# Altium schematic sheet Sheet1.SchDoc
size A4
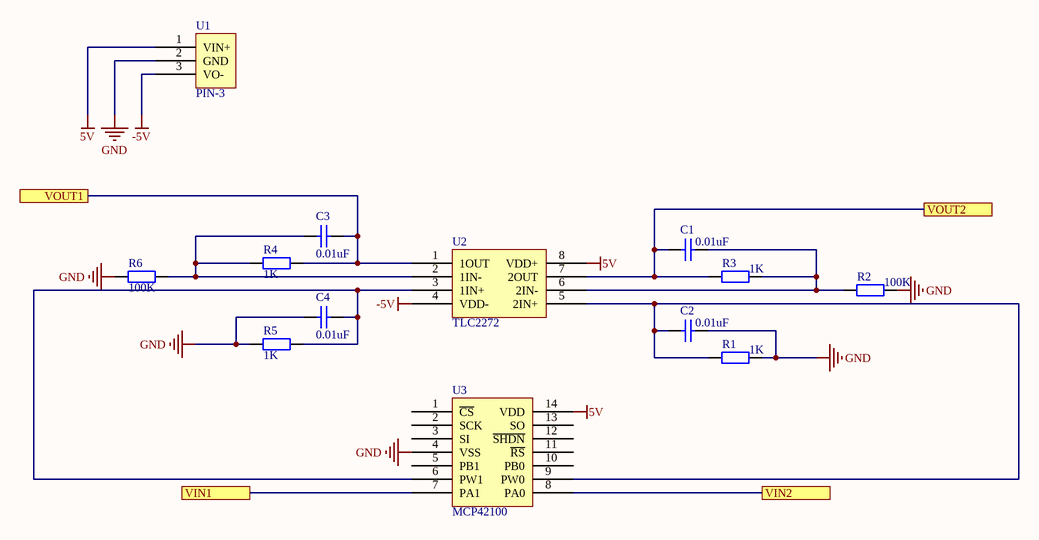
[diagram p0: Sheet1.SchDoc]

## Parts
C1  value 0.01uF  [RAD-0.3]  (hidden comment: Cap)
C2  value 0.01uF  [RAD-0.3]  (hidden comment: Cap)
C3  value 0.01uF  [RAD-0.3]  (hidden comment: Cap)
C4  value 0.01uF  [RAD-0.3]  (hidden comment: Cap)
R1  value 1K  [AXIAL-0.4]  (hidden comment: Res2)
R2  value 100K  [AXIAL-0.4]  (hidden comment: Res2)
R3  value 1K  [AXIAL-0.4]  (hidden comment: Res2)
R4  value 1K  [AXIAL-0.4]  (hidden comment: Res2)
R5  value 1K  [AXIAL-0.4]  (hidden comment: Res2)
R6  value 100K  [AXIAL-0.4]  (hidden comment: Res2)
U1  PIN-3
U2  TLC2272
U3  MCP42100

## Ports
VIN1, VIN2, VOUT1, VOUT2

## Nets
5V: U1.1(VIN+) U2.8(VDD+) U3.14(VDD)
-5V: U1.3(VO-) U2.4(VDD-)
GND: C2.2 C4.2 R1.2 R2.2 R5.2 R6.2 U1.2(GND) U3.4(VSS)
VIN1: U3.7(PA1) ; port VIN1
VIN2: U3.8(PA0) ; port VIN2
VOUT1: C3.1 R4.1 U2.1(1OUT) ; port VOUT1
VOUT2: C1.1 R3.1 U2.7(2OUT) ; port VOUT2
NetC1_2: C1.2 R2.1 R3.2 U2.6(2IN-)
NetC2_1: C2.1 R1.1 U2.5(2IN+) U3.9(PW0)
NetC3_2: C3.2 R4.2 R6.1 U2.2(1IN-)
NetC4_1: C4.1 R5.1 U2.3(1IN+) U3.6(PW1)

Not connected (* = marked no-connect by the designer): U3 1(~{CS}) 2(SCK) 3(SI) 5(PB1) 10(PB0) 11(~{RS}) 12(~{SHDN}) 13(SO)

## Library data of the parts
C1-C4 = Cap: Capacitor; Published: 8-Jun-2000; LatestRevisionDate: 17-Jul-2002; LatestRevisionNote: Re-released for DXP Platform.; PackageReference: RAD-0.3; Publisher: Altium Limited; PackageDescription: Radial Cap, Thru-Hole; 2 Leads; 0.3 in Pin Spacing
R1-R6 = Res2: Resistor; Published: 8-Jun-2000; LatestRevisionDate: 17-Jul-2002; LatestRevisionNote: Re-released for DXP Platform.; PackageReference: AXIAL-0.4; Publisher: Altium Limited; PackageDescription: Axial Device, Thru-Hole; 2 Leads; 0.4 in Pin Spacing